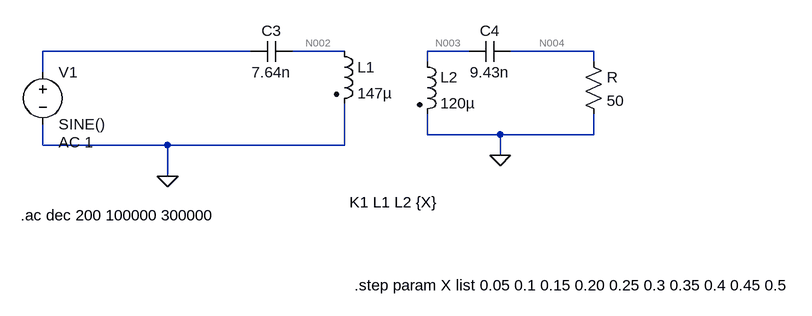
[diagram p0: schematic 1P1S_sweep.asc]
1P1S_sweep.asc, the LTspice schematic file:
Version 4
SHEET 1 3320 1684
WIRE 1072 640 752 640
WIRE 1216 640 1136 640
WIRE 1408 640 1344 640
WIRE 1600 640 1472 640
WIRE 1344 656 1344 640
WIRE 1600 656 1600 640
WIRE 752 672 752 640
WIRE 1344 768 1344 736
WIRE 1456 768 1344 768
WIRE 1600 768 1600 736
WIRE 1600 768 1456 768
WIRE 752 784 752 752
WIRE 944 784 752 784
WIRE 1216 784 1216 720
WIRE 1216 784 944 784
WIRE 1456 800 1456 768
WIRE 944 832 944 784
FLAG 944 832 0
FLAG 1456 800 0
SYMBOL ind2 1200 624 R0
SYMATTR InstName L1
SYMATTR Value 147µ
SYMATTR Type ind
SYMBOL cap 1136 624 R90
WINDOW 0 0 32 VBottom 2
WINDOW 3 32 32 VTop 2
SYMATTR InstName C3
SYMATTR Value 7.64n
SYMBOL ind2 1328 640 R0
SYMATTR InstName L2
SYMATTR Value 120µ
SYMATTR Type ind
SYMBOL cap 1472 624 R90
WINDOW 0 0 32 VBottom 2
WINDOW 3 32 32 VTop 2
SYMATTR InstName C4
SYMATTR Value 9.43n
SYMBOL res 1584 640 R0
SYMATTR InstName R
SYMATTR Value 50
SYMBOL voltage 752 656 R0
WINDOW 123 24 124 Left 2
WINDOW 39 0 0 Left 0
SYMATTR InstName V1
SYMATTR Value SINE()
SYMATTR Value2 AC 1
TEXT 1224 872 Left 2 !K1 L1 L2 {X}
TEXT 718 892 Left 2 !.ac dec 200 100000 300000
TEXT 1232 1000 Left 2 !.step param X list 0.05 0.1 0.15 0.20 0.25 0.3 0.35 0.4 0.45 0.5

The netlist it stands for:
* 1P1S_sweep.asc
L1 N002 0 147µ
C3 N002 N001 7.64n
L2 N003 0 120µ
C4 N004 N003 9.43n
R N004 0 50
V1 N001 0 SINE() AC 1
K1 L1 L2 {X}
.ac dec 200 100000 300000
.step param X list 0.05 0.1 0.15 0.20 0.25 0.3 0.35 0.4 0.45 0.5
.backanno
.end

* Results of the author's LTspice run, read from the files saved beside the schematic
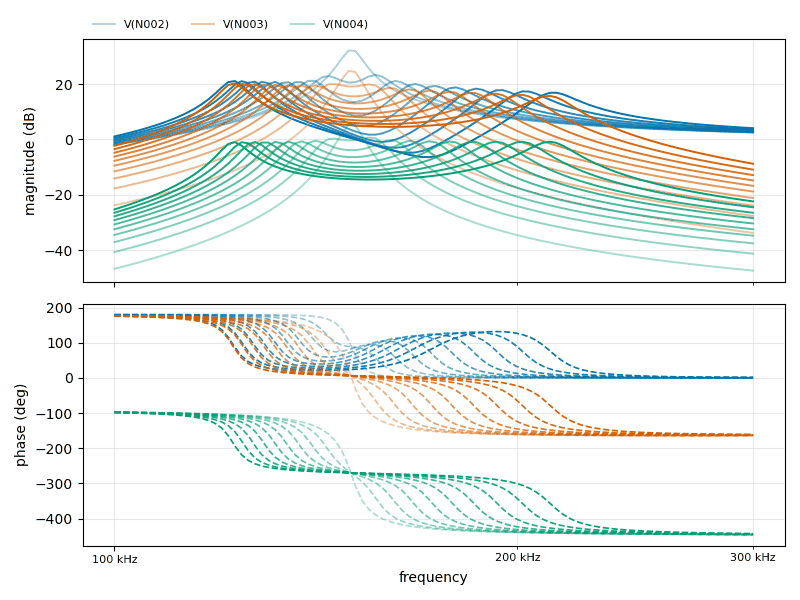
[diagram p1: AC Analysis of 1P1S_sweep.asc, plotted from the saved traces]
* AC Analysis, 10 runs:
*   V(N002) [x=0.05]: -1.94 dB at 100 kHz, 2.52 dB at 300 kHz, peak 32.16 dB at 149.6 kHz, 3 dB below the peak at 147.8 kHz and 153 kHz
*   V(N002) [x=0.1]: -1.85 dB at 100 kHz, 2.54 dB at 300 kHz, peak 23.34 dB at 156.7 kHz, 3 dB below the peak at 140.9 kHz and 161.3 kHz
*   V(N002) [x=0.15]: -1.70 dB at 100 kHz, 2.60 dB at 300 kHz, peak 21.19 dB at 139.6 kHz, 3 dB below the peak at 136.6 kHz and 144.1 kHz
*   V(N002) [x=0.2]: -1.48 dB at 100 kHz, 2.67 dB at 300 kHz, peak 20.70 dB at 136.5 kHz, 3 dB below the peak at 133.6 kHz and 140.6 kHz
*   V(N002) [x=0.25]: -1.20 dB at 100 kHz, 2.77 dB at 300 kHz, peak 20.67 dB at 134.9 kHz, 3 dB below the peak at 131 kHz and 137.6 kHz
*   V(N002) [x=0.3]: -0.87 dB at 100 kHz, 2.91 dB at 300 kHz, peak 20.80 dB at 131.8 kHz, 3 dB below the peak at 128.6 kHz and 134.8 kHz
*   V(N002) [x=0.35]: -0.47 dB at 100 kHz, 3.09 dB at 300 kHz, peak 20.80 dB at 128.8 kHz, 3 dB below the peak at 126.2 kHz and 132.3 kHz
*   V(N002) [x=0.4]: -0.01 dB at 100 kHz, 3.32 dB at 300 kHz, peak 20.87 dB at 127.4 kHz, 3 dB below the peak at 124 kHz and 129.8 kHz
*   V(N003) [x=0.05]: -23.77 dB at 100 kHz, -33.79 dB at 300 kHz, peak 24.77 dB at 149.6 kHz, 3 dB below the peak at 147.9 kHz and 152.6 kHz
*   V(N003) [x=0.1]: -17.71 dB at 100 kHz, -27.65 dB at 300 kHz, peak 19.98 dB at 146.2 kHz, 3 dB below the peak at 141.8 kHz and 159.2 kHz
*   V(N003) [x=0.15]: -14.12 dB at 100 kHz, -23.93 dB at 300 kHz, peak 19.54 dB at 141.3 kHz, 3 dB below the peak at 137.9 kHz and 146.7 kHz
*   V(N003) [x=0.2]: -11.52 dB at 100 kHz, -21.15 dB at 300 kHz, peak 19.50 dB at 138 kHz, 3 dB below the peak at 134.7 kHz and 142.1 kHz
*   V(N003) [x=0.25]: -9.46 dB at 100 kHz, -18.83 dB at 300 kHz, peak 19.61 dB at 134.9 kHz, 3 dB below the peak at 131.8 kHz and 138.6 kHz
*   V(N003) [x=0.3]: -7.71 dB at 100 kHz, -16.76 dB at 300 kHz, peak 19.72 dB at 131.8 kHz, 3 dB below the peak at 129.1 kHz and 135.6 kHz
*   V(N003) [x=0.35]: -6.18 dB at 100 kHz, -14.81 dB at 300 kHz, peak 19.68 dB at 128.8 kHz, 3 dB below the peak at 126.6 kHz and 133 kHz
*   V(N003) [x=0.4]: -4.80 dB at 100 kHz, -12.88 dB at 300 kHz, peak 19.99 dB at 127.4 kHz, 3 dB below the peak at 124.3 kHz and 130.2 kHz
*   V(N004) [x=0.05]: -46.76 dB at 100 kHz, -47.40 dB at 300 kHz, peak 5.26 dB at 149.6 kHz, 3 dB below the peak at 147.9 kHz and 152.7 kHz
*   V(N004) [x=0.1]: -40.69 dB at 100 kHz, -41.26 dB at 300 kHz, peak 0.68 dB at 154.9 kHz, 3 dB below the peak at 142.2 kHz and 159.4 kHz
*   V(N004) [x=0.15]: -37.10 dB at 100 kHz, -37.55 dB at 300 kHz, peak -0.27 dB at 160.3 kHz, 3 dB below the peak at 153.8 kHz and 165.2 kHz
*   V(N004) [x=0.2]: -34.51 dB at 100 kHz, -34.76 dB at 300 kHz, peak -0.52 dB at 166 kHz, 3 dB below the peak at 160.4 kHz and 171 kHz
*   V(N004) [x=0.25]: -32.44 dB at 100 kHz, -32.44 dB at 300 kHz, peak -0.64 dB at 171.8 kHz, 3 dB below the peak at 166.1 kHz and 177.1 kHz
*   V(N004) [x=0.3]: -30.70 dB at 100 kHz, -30.37 dB at 300 kHz, peak -0.74 dB at 177.8 kHz, 3 dB below the peak at 172.1 kHz and 183.7 kHz
*   V(N004) [x=0.35]: -29.17 dB at 100 kHz, -28.42 dB at 300 kHz, peak -0.88 dB at 186.2 kHz, 3 dB below the peak at 178.5 kHz and 191.2 kHz
*   V(N004) [x=0.4]: -27.78 dB at 100 kHz, -26.49 dB at 300 kHz, peak -0.79 dB at 192.8 kHz, 3 dB below the peak at 185.9 kHz and 199.2 kHz